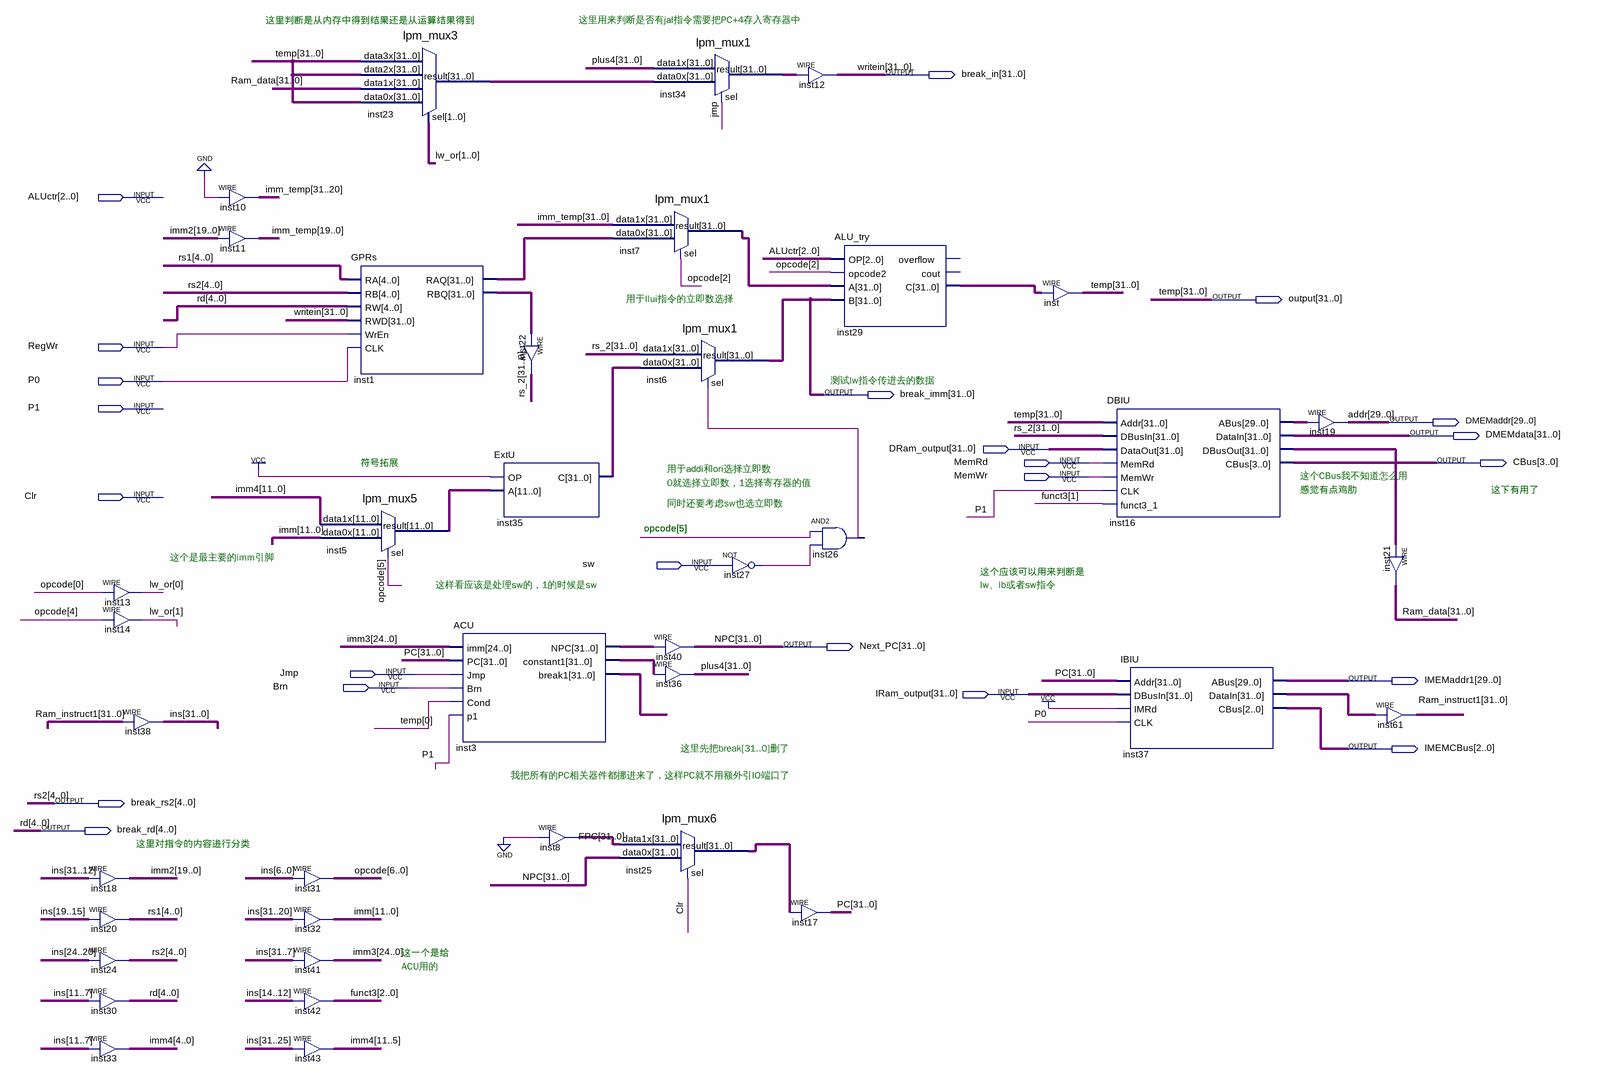
[diagram p0: schematic sheet]
// Quartus schematic datapath.bdf as structural Verilog: 39 symbols, 23 pins
module datapath (
  input  [2:0] ALUctr,
  input  RegWr,
  input  P0,
  input  P1,
  input  [31:0] DRam_output,
  input  MemRd,
  input  MemWr,
  input  Clr,
  input  sw,
  input  Jmp,
  input  Brn,
  input  [31:0] IRam_output,
  output [31:0] break_in,
  output [31:0] \output ,
  output [31:0] break_imm,
  output [29:0] DMEMaddr,
  output [31:0] DMEMdata,
  output [3:0] CBus,
  output [31:0] Next_PC,
  output [29:0] IMEMaddr1,
  output [2:0] IMEMCBus,
  output [4:0] break_rs2,
  output [4:0] break_rd
);

  wire inst26_out, inst27_out;
  wire [1:0] lw_or;
  wire [2:0] funct3;
  wire [4:0] rs1;
  wire [6:0] opcode;
  wire [11:0] imm, imm4, inst5_result;
  wire [19:0] imm2;
  wire [24:0] imm3;
  wire [29:0] inst16_abus;
  wire [31:0] FPC, imm_temp, ins, inst1_raq, inst1_rbq, inst3_break1, inst3_constant1, inst3_npc,
       inst7_result, inst16_dbusout, inst23_result, inst25_result, inst29_c, inst34_result, inst35_c,
       inst37_datain, PC, plus4, Ram_data, Ram_instruct1, rs_2;

  assign imm2 = ins[31:12];  // WIRE inst18
  assign rs1 = ins[19:15];  // WIRE inst20
  assign break_rs2 = ins[24:20];  // WIRE inst24
  assign break_rd = ins[11:7];  // WIRE inst30
  assign imm4[4:0] = ins[11:7];  // WIRE inst33
  assign lw_or[0] = opcode[0];  // WIRE inst13
  assign lw_or[1] = opcode[4];  // WIRE inst14
  assign ins = Ram_instruct1;  // WIRE inst38
  assign imm_temp[31:20] = {12{1'b0}};  // WIRE inst10
  assign imm_temp[19:0] = imm2;  // WIRE inst11
  assign opcode = ins[6:0];  // WIRE inst31
  assign imm = ins[31:20];  // WIRE inst32
  assign imm3 = ins[31:7];  // WIRE inst41
  assign funct3 = ins[14:12];  // WIRE inst42
  assign imm4[11:5] = ins[31:25];  // WIRE inst43
  lpm_mux3 inst23 (
    .data3x(\output ), .data2x(\output ), .data1x(Ram_data), .data0x(\output ), .sel(lw_or),
    .result(inst23_result));
  GPRs inst1 (
    .RA(rs1), .RB(break_rs2), .RW(break_rd), .RWD(break_in), .WrEn(RegWr), .CLK(P0), .RAQ(inst1_raq),
    .RBQ(inst1_rbq));
  lpm_mux5 inst5 (.data1x(imm4), .data0x(imm), .sel(opcode[5]), .result(inst5_result));
  ACU inst3 (
    .imm(imm3), .PC(PC), .Jmp(Jmp), .Brn(Brn), .Cond(\output [0]), .p1(P1), .NPC(inst3_npc),
    .constant1(inst3_constant1), .break1(inst3_break1));
  assign rs_2 = inst1_rbq;  // WIRE inst22
  ExtU inst35 (.OP(1'b1), .A(inst5_result), .C(inst35_c));
  assign FPC = {32{1'b0}};  // WIRE inst8
  lpm_mux1 inst7 (.data1x(imm_temp), .data0x(inst1_raq), .sel(opcode[2]), .result(inst7_result));
  lpm_mux6 inst25 (.data1x(FPC), .data0x(Next_PC), .sel(Clr), .result(inst25_result));
  lpm_mux1 inst34 (.data1x(plus4), .data0x(inst23_result), .sel(Jmp), .result(inst34_result));
  lpm_mux1 inst6 (.data1x(rs_2), .data0x(inst35_c), .sel(inst26_out), .result(break_imm));
  assign Next_PC = inst3_npc;  // WIRE inst40
  assign plus4 = inst3_constant1;  // WIRE inst36
  not inst27 (inst27_out, sw);
  assign break_in = inst34_result;  // WIRE inst12
  assign PC = inst25_result;  // WIRE inst17
  ALU_try inst29 (
    .OP(ALUctr), .opcode2(opcode[2]), .A(inst7_result), .B(break_imm), .C(inst29_c));  // open: overflow, cout
  and inst26 (inst26_out, opcode[5], inst27_out);
  assign \output  = inst29_c;  // WIRE inst
  DBIU inst16 (
    .Addr(\output ), .DBusIn(rs_2), .DataOut(DRam_output), .MemRd(MemRd), .MemWr(MemWr), .CLK(P1),
    .funct3_1(funct3[1]), .ABus(inst16_abus), .DataIn(DMEMdata), .DBusOut(inst16_dbusout), .CBus(CBus));
  IBIU inst37 (
    .Addr(PC), .DBusIn(IRam_output), .IMRd(1'b1), .CLK(P0), .ABus(IMEMaddr1), .DataIn(inst37_datain),
    .CBus(IMEMCBus));
  assign DMEMaddr = inst16_abus;  // WIRE inst19
  assign Ram_data = inst16_dbusout;  // WIRE inst21
  assign Ram_instruct1 = inst37_datain;  // WIRE inst61

  // Other names for the same wires on the sheet: addr[29:0] = DMEMaddr; NPC[31:0] = Next_PC; rd[4:0] = break_rd;
  //   rs2[4:0] = break_rs2; temp[31:0] = \output ; writein[31:0] = break_in

  // Notes on the sheet:
  //   这里判断是从内存中得到结果还是从运算结果得到
  //   这里用来判断是否有jal指令需要把PC+4存入寄存器中
  //   用于llui指令的立即数选择
  //   测试lw指令传进去的数据
  //   符号拓展
  //   用于addi和ori选择立即数
  //   这个CBus我不知道怎么用
  //   0就选择立即数，1选择寄存器的值
  //   感觉有点鸡肋
  //   这下有用了
  //   同时还要考虑sw也选立即数
  //   opcode[5]
  //   这个是最主要的imm引脚
  //   这个应该可以用来判断是
  //   这样看应该是处理sw的，1的时候是sw
  //   lw、lb或者sw指令
  //   这里先把break[31..0]删了
  //   我把所有的PC相关器件都挪进来了，这样PC就不用额外引IO端口了
  //   这里对指令的内容进行分类
  //   这一个是给
  //   ACU用的
endmodule
